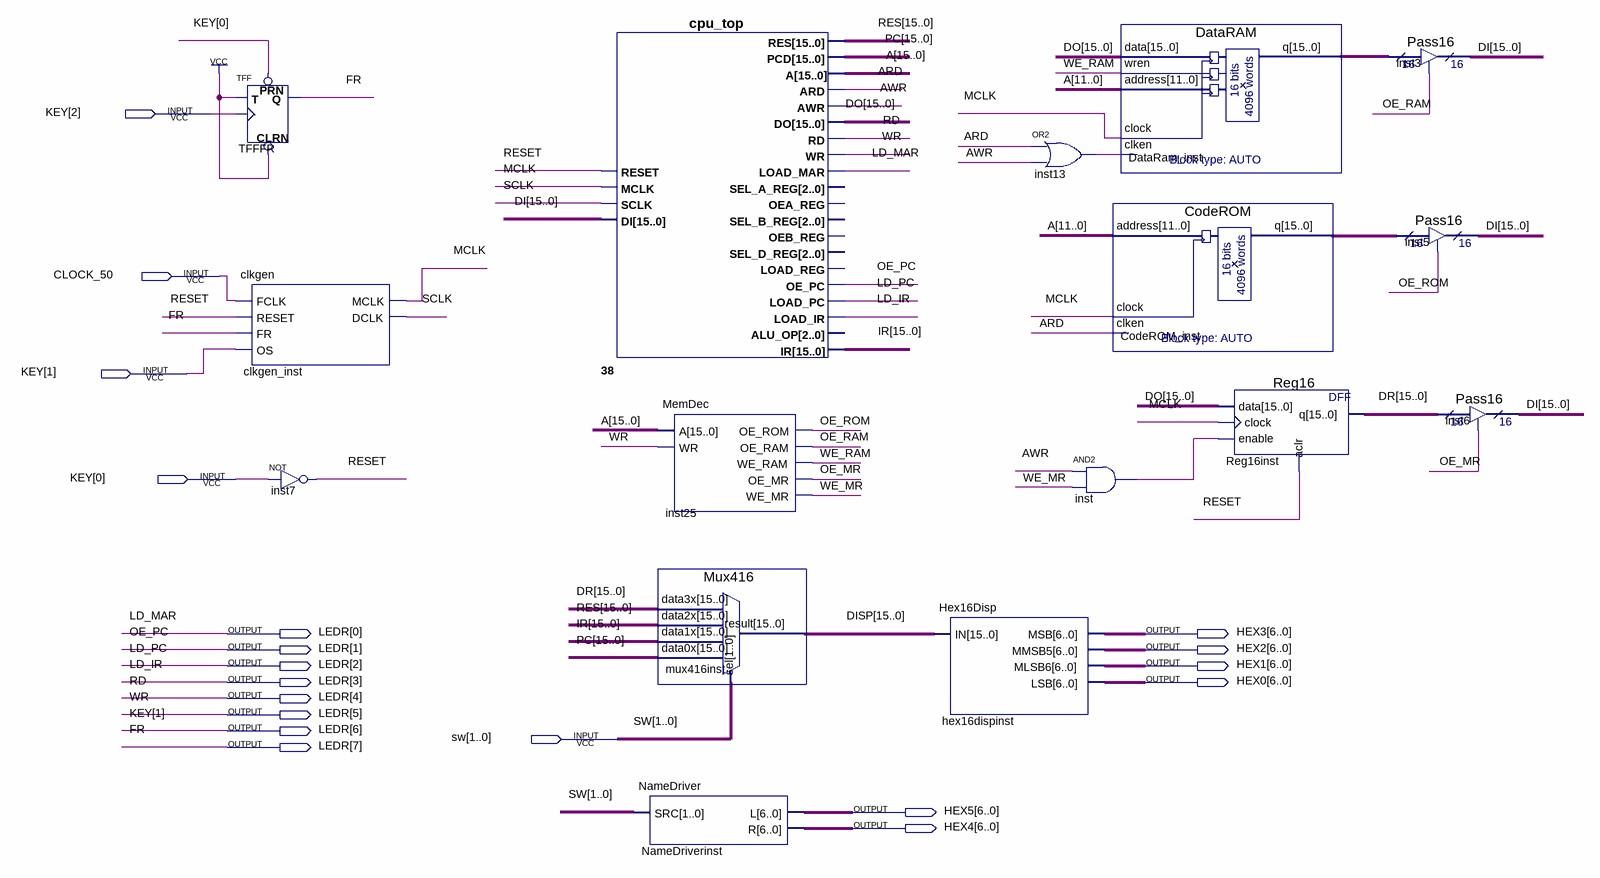
[diagram p0: schematic sheet]
// Quartus schematic T4-DE10.bdf as structural Verilog: 16 symbols, 19 pins
module \T4-DE10  (
  input  [2:0] KEY,
  input  CLOCK_50,
  input  [1:0] sw,
  output [7:0] LEDR,
  output [6:0] HEX3,
  output [6:0] HEX2,
  output [6:0] HEX1,
  output [6:0] HEX0,
  output [6:0] HEX5,
  output [6:0] HEX4
);

  wire ARD, AWR, inst13_out, inst_out, MCLK, OE_MR, OE_RAM, OE_ROM, RESET, SCLK, WE_MR, WE_RAM;
  wire [15:0] A, CodeROM_inst_q, DataRam_inst_q, DI, DISP, DO, DR, IR, PC, RES;

  TFF TFFFR (.PRN(KEY[0]), .CLRN(1'b1), .T(1'b1), .CLK(KEY[2]), .Q(LEDR[7]));
  clkgen clkgen_inst (.FCLK(CLOCK_50), .RESET(RESET), .FR(LEDR[7]), .OS(KEY[1]), .MCLK(MCLK), .DCLK(SCLK));
  not inst7 (RESET, KEY[0]);
  cpu_top u_38 (
    .RESET(RESET), .MCLK(MCLK), .SCLK(SCLK), .DI(DI), .PCD(PC), .A(A), .ARD(ARD), .AWR(AWR), .DO(DO),
    .RD(LEDR[4]), .WR(LEDR[5]), .LOAD_MAR(LEDR[0]), .OE_PC(LEDR[1]), .LOAD_PC(LEDR[2]), .LOAD_IR(LEDR[3]),
    .IR(IR), .RES(RES));  // open: SEL_A_REG, OEA_REG, SEL_B_REG, OEB_REG, SEL_D_REG, LOAD_REG, ALU_OP
  MemDec inst25 (.A(A), .WR(LEDR[5]), .OE_ROM(OE_ROM), .OE_RAM(OE_RAM), .WE_RAM(WE_RAM), .OE_MR(OE_MR), .WE_MR(WE_MR));
  Mux416 mux416inst (.data3x(DR), .data2x(RES), .data1x(IR), .data0x(PC), .sel(sw), .result(DISP));
  NameDriver NameDriverinst (.SRC(sw), .L(HEX5), .R(HEX4));
  Hex16Disp hex16dispinst (.IN(DISP), .MSB(HEX3), .MMSB5(HEX2), .MLSB6(HEX1), .LSB(HEX0));
  or inst13 (inst13_out, ARD, AWR);
  and inst (inst_out, AWR, WE_MR);
  DataRAM DataRam_inst (
    .data(DO), .wren(WE_RAM), .address(A[11:0]), .clock(MCLK), .clken(inst13_out), .q(DataRam_inst_q));
  CodeROM CodeROM_inst (.address(A[11:0]), .clock(MCLK), .clken(ARD), .q(CodeROM_inst_q));
  Reg16 Reg16inst (.data(DO), .clock(MCLK), .enable(inst_out), .aclr(RESET), .q(DR));
  Pass16 inst3 (.enabledt(OE_RAM), .data(DataRam_inst_q), .tridata(DI));
  Pass16 inst5 (.enabledt(OE_ROM), .data(CodeROM_inst_q), .tridata(DI));
  Pass16 inst6 (.enabledt(OE_MR), .data(DR), .tridata(DI));

  assign LEDR[6] = KEY[1];

  // Other names for the same wires on the sheet: FR = LEDR[7]; LD_IR = LEDR[3]; LD_MAR = LEDR[0]; LD_PC = LEDR[2];
  //   OE_PC = LEDR[1]; RD = LEDR[4]; WR = LEDR[5]
endmodule
